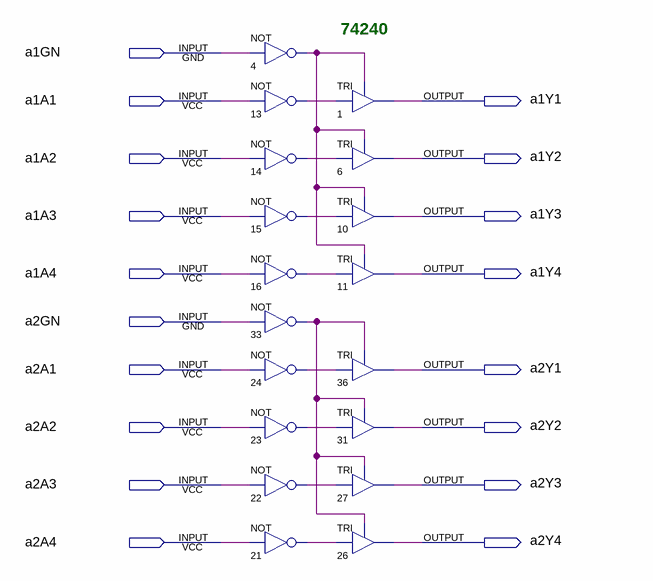
[diagram p0: schematic sheet]
// Quartus schematic a74240.bdf as structural Verilog: 18 symbols, 18 pins
module a74240 (
  input  a1GN,
  input  a1A1,
  input  a1A2,
  input  a1A3,
  input  a1A4,
  input  a2GN,
  input  a2A1,
  input  a2A2,
  input  a2A3,
  input  a2A4,
  output a1Y1,
  output a1Y2,
  output a1Y3,
  output a1Y4,
  output a2Y1,
  output a2Y2,
  output a2Y3,
  output a2Y4
);

  wire n4_out, n13_out, n14_out, n15_out, n16_out, n21_out, n22_out, n23_out, n24_out, n33_out;

  not u_4 (n4_out, a1GN);
  not u_13 (n13_out, a1A1);
  not u_14 (n14_out, a1A2);
  not u_15 (n15_out, a1A3);
  not u_16 (n16_out, a1A4);
  not u_33 (n33_out, a2GN);
  not u_24 (n24_out, a2A1);
  not u_23 (n23_out, a2A2);
  not u_22 (n22_out, a2A3);
  not u_21 (n21_out, a2A4);
  TRI u_1 (.IN(n13_out), .OE(n4_out), .OUT(a1Y1));
  TRI u_6 (.IN(n14_out), .OE(n4_out), .OUT(a1Y2));
  TRI u_10 (.IN(n15_out), .OE(n4_out), .OUT(a1Y3));
  TRI u_11 (.IN(n16_out), .OE(n4_out), .OUT(a1Y4));
  TRI u_36 (.IN(n24_out), .OE(n33_out), .OUT(a2Y1));
  TRI u_31 (.IN(n23_out), .OE(n33_out), .OUT(a2Y2));
  TRI u_27 (.IN(n22_out), .OE(n33_out), .OUT(a2Y3));
  TRI u_26 (.IN(n21_out), .OE(n33_out), .OUT(a2Y4));

  // Notes on the sheet:
  //   74240
endmodule
